# Altium schematic sheet 02 Block.SchDoc
size 420 x 297 mm
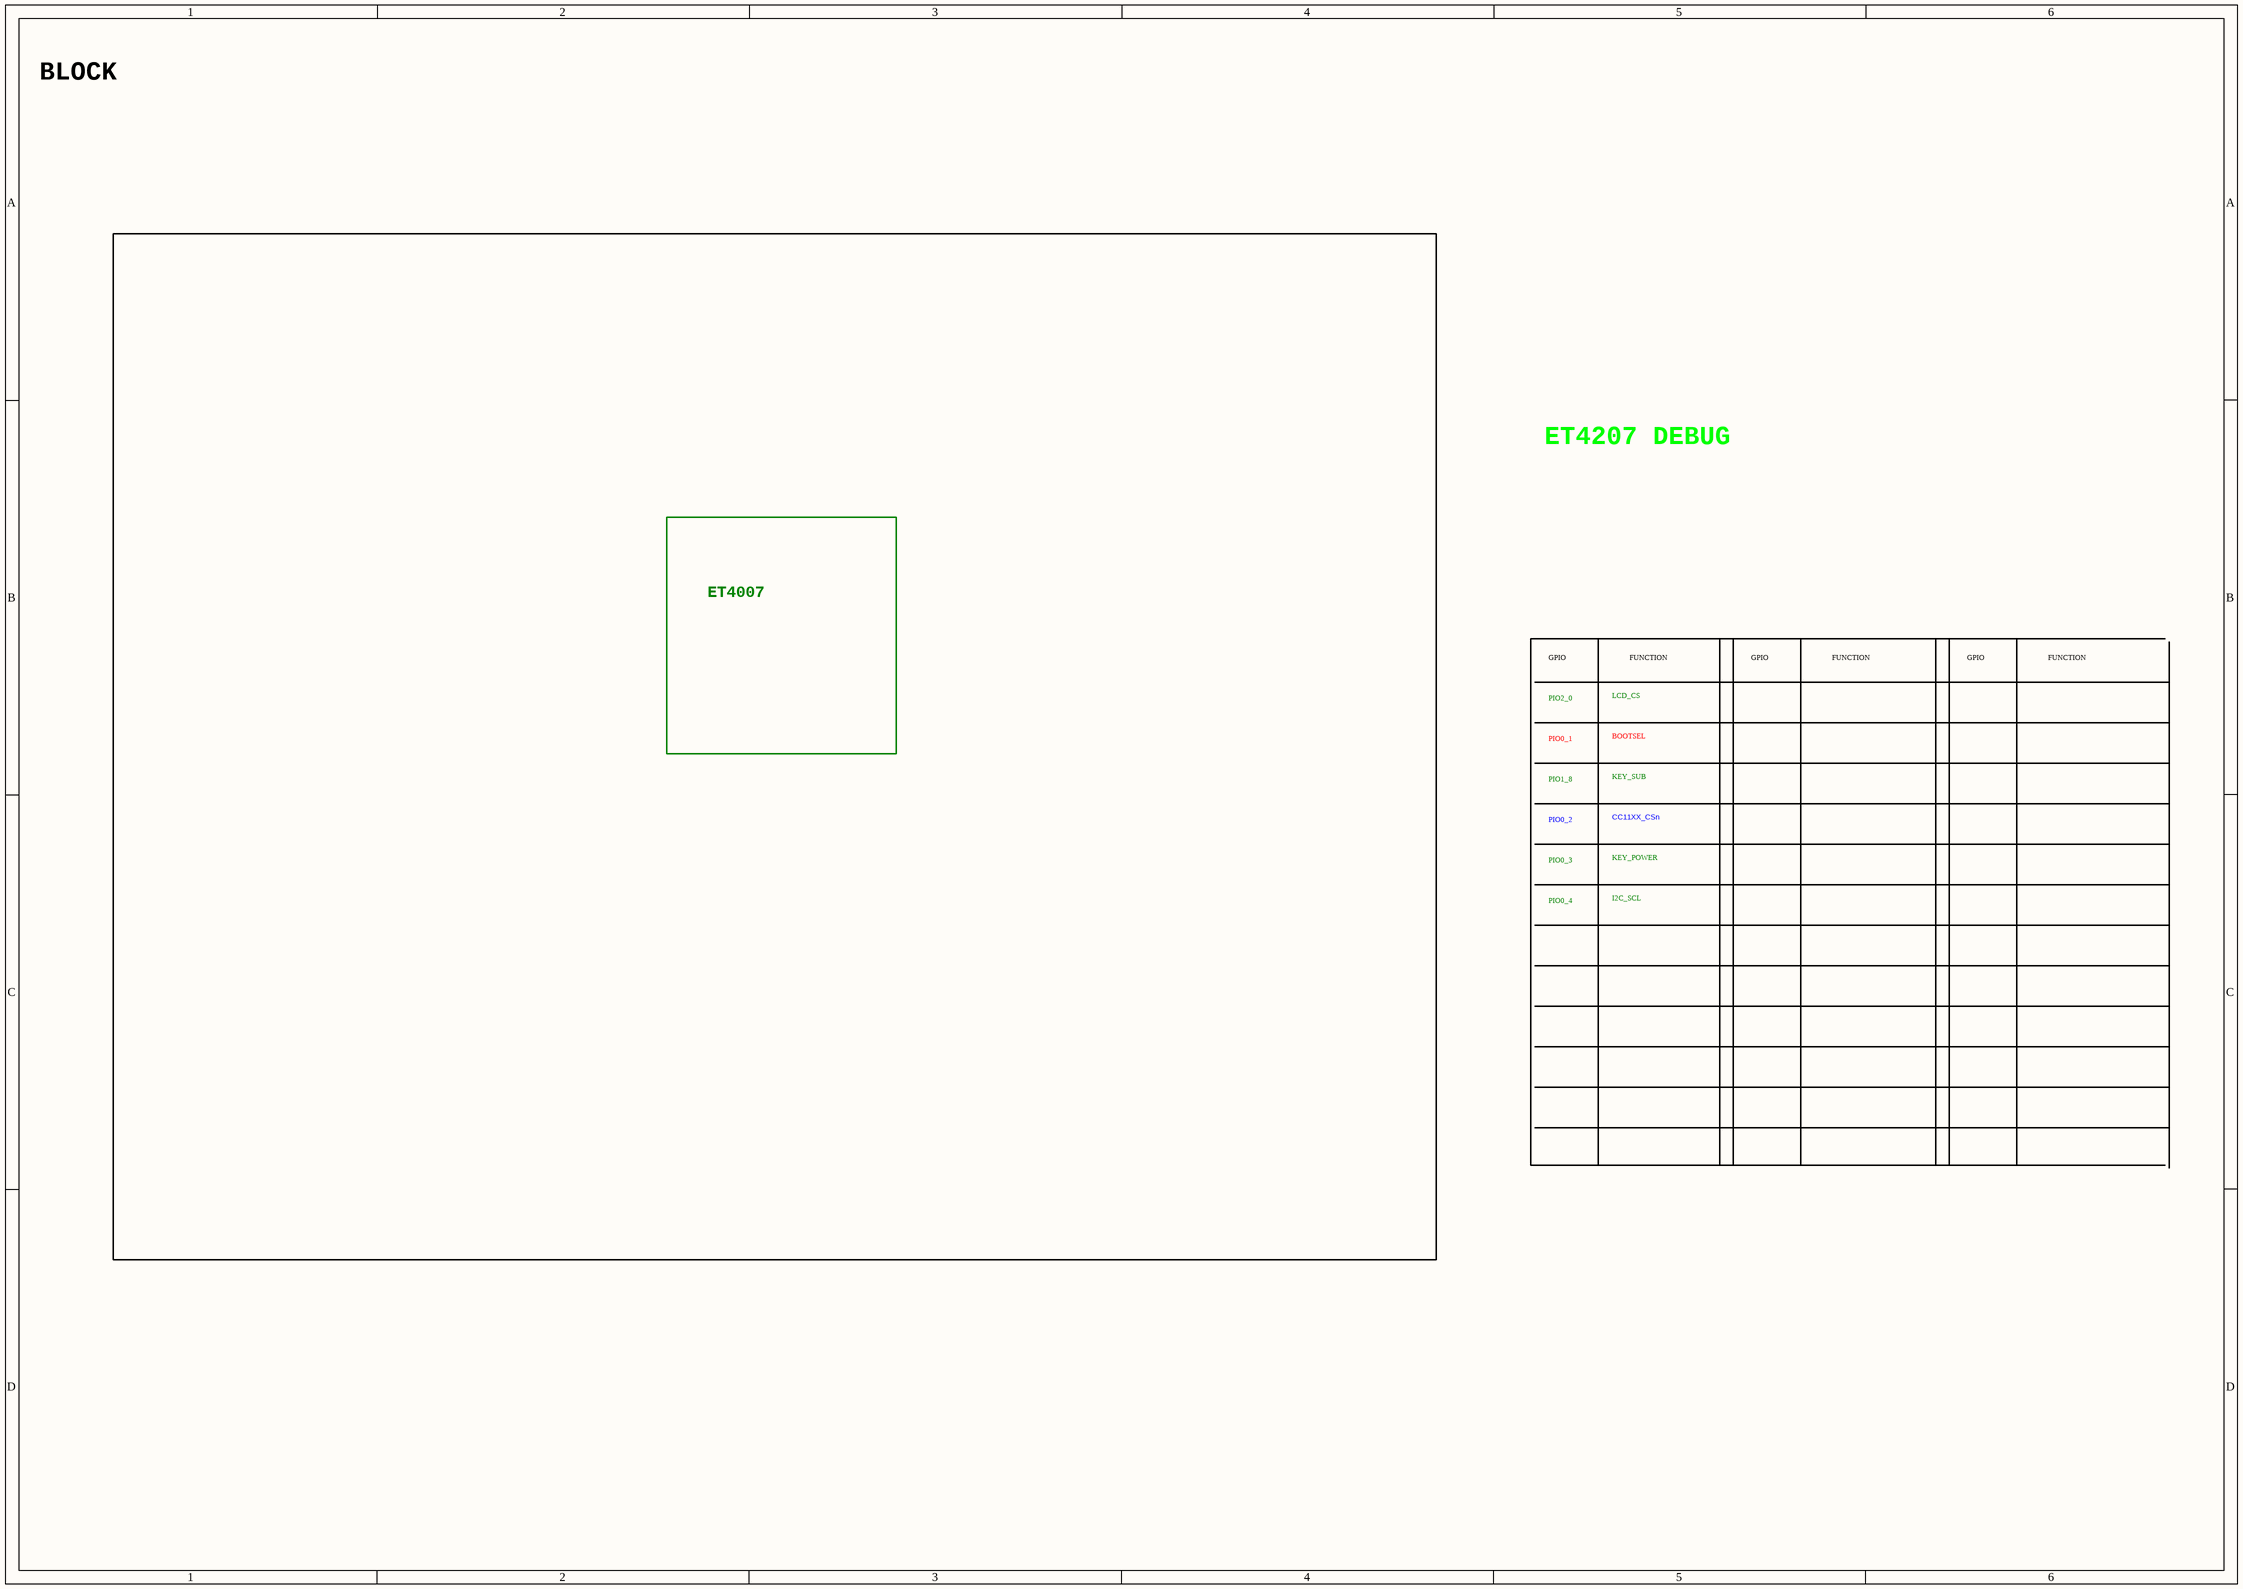
[diagram p0: 02 Block.SchDoc]

## Notes on the sheet
- BLOCK
- ET4207 DEBUG
- ET4007
- GPIO
- FUNCTION
- PIO2_0
- LCD_CS
- PIO0_1
- PIO1_8
- BOOTSEL
- KEY_SUB
- PIO0_3
- PIO0_2
- CC11XX_CSn
- KEY_POWER
- PIO0_4
- I2C_SCL